# Altium schematic sheet DX-BT04-E_SCH_Part_PADS_SCH_Part_AD.SchDoc
size A4
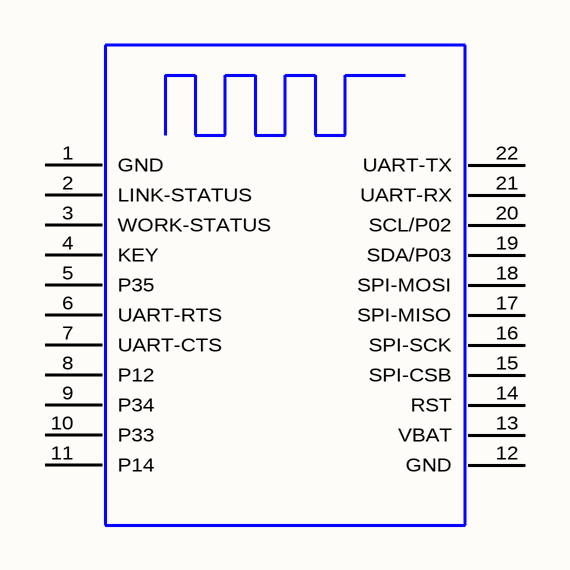
[diagram p0: DX-BT04-E_SCH_Part_PADS_SCH_Part_AD.SchDoc]

## Parts
U?  DX-BT04-E  [DX-BT04-E]  (value not drawn)

## Nets

Not connected (* = marked no-connect by the designer): U? 1(GND) 2(LINK-STATUS) 3(WORK-STATUS) 4(KEY) 5(P35) 6(UART-RTS) 7(UART-CTS) 8(P12) 9(P34) 10(P33) 11(P14) 12(GND) 13(VBAT) 14(RST) 15(SPI-CSB) 16(SPI-SCK) 17(SPI-MISO) 18(SPI-MOSI) 19(SDA/P03) 20(SCL/P02) 21(UART-RX) 22(UART-TX)

## Library data of the parts
U? = DX-BT04-E: PCB DECAL: DX-BT24-S